# Altium schematic sheet Sheet2.SchDoc
size A4
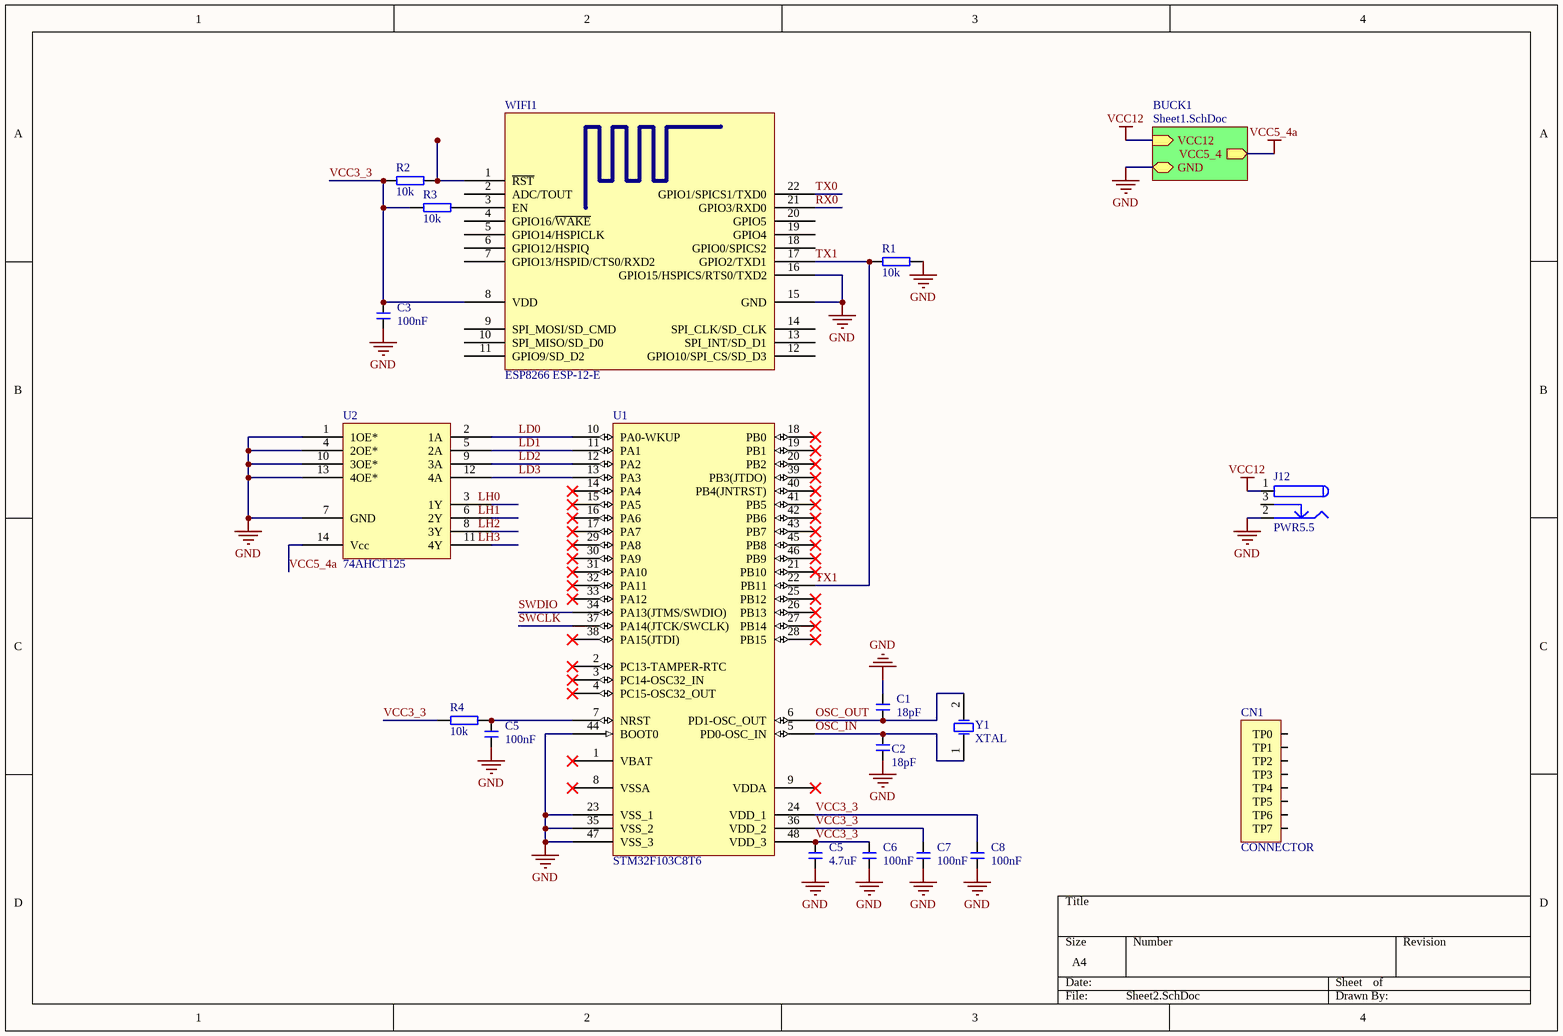
[diagram p0: Sheet2.SchDoc]

## Parts
(Parts that share a designator on the sheet are numbered #1, #2 ... from top to bottom, then left to right.)
C1  18pF  [CAP0402R]
C2  18pF  [CAP0402R]
C3  100nF  [CAP0402R]
C5#1  100nF  [CAP0402R]
C5#2  4.7uF  [CAP0402R]
C6  100nF  [CAP0402R]
C7  100nF  [CAP0402R]
C8  100nF  [CAP0402R]
CN1  CONNECTOR  [EDGE]  (no BOM)
J12  PWR5.5  [KLD-0202]
R1  10k  [RES0402R]
R2  10k  [RES0402R]
R3  10k  [RES0402R]
R4  10k  [RES0402R]
U1  STM32F103C8T6  [SQFP50P900X900-48L]
U2  74AHCT125  [SO-14]
WIFI1  ESP8266 ESP-12-E  [ESP8266 ESP-12-E]
Y1  XTAL  [R38]

## Sub-sheets
BUCK1 = Sheet1.SchDoc: GND (bidir), VCC5_4 (out), VCC12 (in)

## Nets
GND: C1.1 C2.2 C3.2 C5#1.2 C5#2.2 C6.2 C7.2 C8.2 J12.2 R1.2 U1.23(VSS_1) U1.35(VSS_2) U1.44(BOOT0) U1.47(VSS_3) U2.1(1OE*) U2.4(2OE*) U2.7(GND) U2.10(3OE*) U2.13(4OE*) WIFI1.15(GND) WIFI1.16(GPIO15/HSPICS/RTS0/TXD2) ; sheet BUCK1/GND
VCC5_4a: U2.14(Vcc) ; sheet BUCK1/VCC5_4
VCC12: J12.1 ; sheet BUCK1/VCC12
LD0: U1.10(PA0-WKUP) U2.2(1A)
LD1: U1.11(PA1) U2.5(2A)
LD2: U1.12(PA2) U2.9(3A)
LD3: U1.13(PA3) U2.12(4A)
OSC_IN: C2.1 U1.5(PD0-OSC_IN) Y1.1(OSC1)
OSC_OUT: C1.2 U1.6(PD1-OSC_OUT) Y1.2(OSC2)
RX0: WIFI1.21(GPIO3/RXD0)
SWCLK: U1.37(PA14(JTCK/SWCLK))
SWDIO: U1.34(PA13(JTMS/SWDIO))
TX0: WIFI1.22(GPIO1/SPICS1/TXD0)
TX1: R1.1 U1.22(PB11) WIFI1.17(GPIO2/TXD1)
VCC3_3: C3.1 C5#2.1 C6.1 C7.1 C8.1 R2.1 R3.1 R4.1 U1.24(VDD_1) U1.36(VDD_2) U1.48(VDD_3) WIFI1.8(VDD)
NetC5#1_1: C5#1.1 R4.2 U1.7(NRST)
NetR2_2: R2.2 WIFI1.1(~{RST})
NetR3_2: R3.2 WIFI1.3(EN)

Not connected (* = marked no-connect by the designer): CN1 1(TP0) 2(TP1) 3(TP2) 4(TP3) 5(TP4) 6(TP5) 7(TP6) 8(TP7); J12 3; U1 1(VBAT)* 2(PC13-TAMPER-RTC)* 3(PC14-OSC32_IN)* 4(PC15-OSC32_OUT)* 8(VSSA)* 9(VDDA)* 14(PA4)* 15(PA5)* 16(PA6)* 17(PA7)* 18(PB0)* 19(PB1)* 20(PB2)* 21(PB10)* 25(PB12)* 26(PB13)* 27(PB14)* 28(PB15)* 29(PA8)* 30(PA9)* 31(PA10)* 32(PA11)* 33(PA12)* 38(PA15(JTDI))* 39(PB3(JTDO))* 40(PB4(JNTRST))* 41(PB5)* 42(PB6)* 43(PB7)* 45(PB8)* 46(PB9)*; U2 3(1Y) 6(2Y) 8(3Y) 11(4Y); WIFI1 2(ADC/TOUT) 4(GPIO16/~{WAKE}) 5(GPIO14/HSPICLK) 6(GPIO12/HSPIQ) 7(GPIO13/HSPID/CTS0/RXD2) 9(SPI_MOSI/SD_CMD) 10(SPI_MISO/SD_D0) 11(GPIO9/SD_D2) 12(GPIO10/SPI_CS/SD_D3) 13(SPI_INT/SD_D1) 14(SPI_CLK/SD_CLK) 18(GPIO0/SPICS2) 19(GPIO4) 20(GPIO5)

## Notes on the sheet
- Labels drawn without touching a wire or pin: LH0, LH1, LH2, LH3

## Library data of the parts
C1-C3 C5#1 C5#2 C6-C8 = CAP: Capacitor; Note: *; Desc: *
  C1 C2: Value: 18pF
  C3 C5#1 C6-C8: Value: 100nF
  C5#2: Value: 4.7uF
J12 = PWR2.5: Low Voltage Power Supply Connector; Published: 17-Dec-2003; DatasheetDocument: 09-May-2002; Publisher: Altium Limited; ComponentLink1Description: Manufacturer Link; ComponentLink1URL: http://domino.kycon.com/internet/Products.html
R1-R4 = RES: Resistor; Value: 10k; Note: *; Desc: *
U1 = STM32F103C8T6: Medium-density performance line ARM-based 32-bit MCU with 64 or 128 KB Flash, USB, CAN, 7 timers, 2 ADCs, 9 com. interfaces
Y1 = XTAL: Crystal Oscillator; Published: 8-Jun-2000; LatestRevisionDate: 17-Jul-2002; LatestRevisionNote: Re-released for DXP Platform.; PackageReference: R38; Publisher: Altium Limited; PackageDescription: Crystal, Thru-Hole; 2 Leads; Body 3.1 x 8.2 mm (Dia.xH)